# Altium schematic sheet AMC_Connector.SchDoc: =ProjectName
size 420 x 297 mm; Author: T.P.; CompanyName: WUT; DrawnBy: T.P.; Organization: WUT ISE; Address1: Warsaw Univeristy of Technology; Address2: Nowowiejska 15/19; DocumentNumber: 35; Revision: 0.9; SheetNumber: 35; SheetTotal: 36; EDA_Number: ARTIQ; Projet: ARTIQ/SINARA; ModifiedBy: -; CreateDate: XX/XX/XXXX; CheckedDate: -; Title2: AMC_Connector.SchDoc; DivGrp: ISE; Designer: G.K. and T.P.; ModifiedDate: -; ProjectName: ADC/DAC MEZZANINE
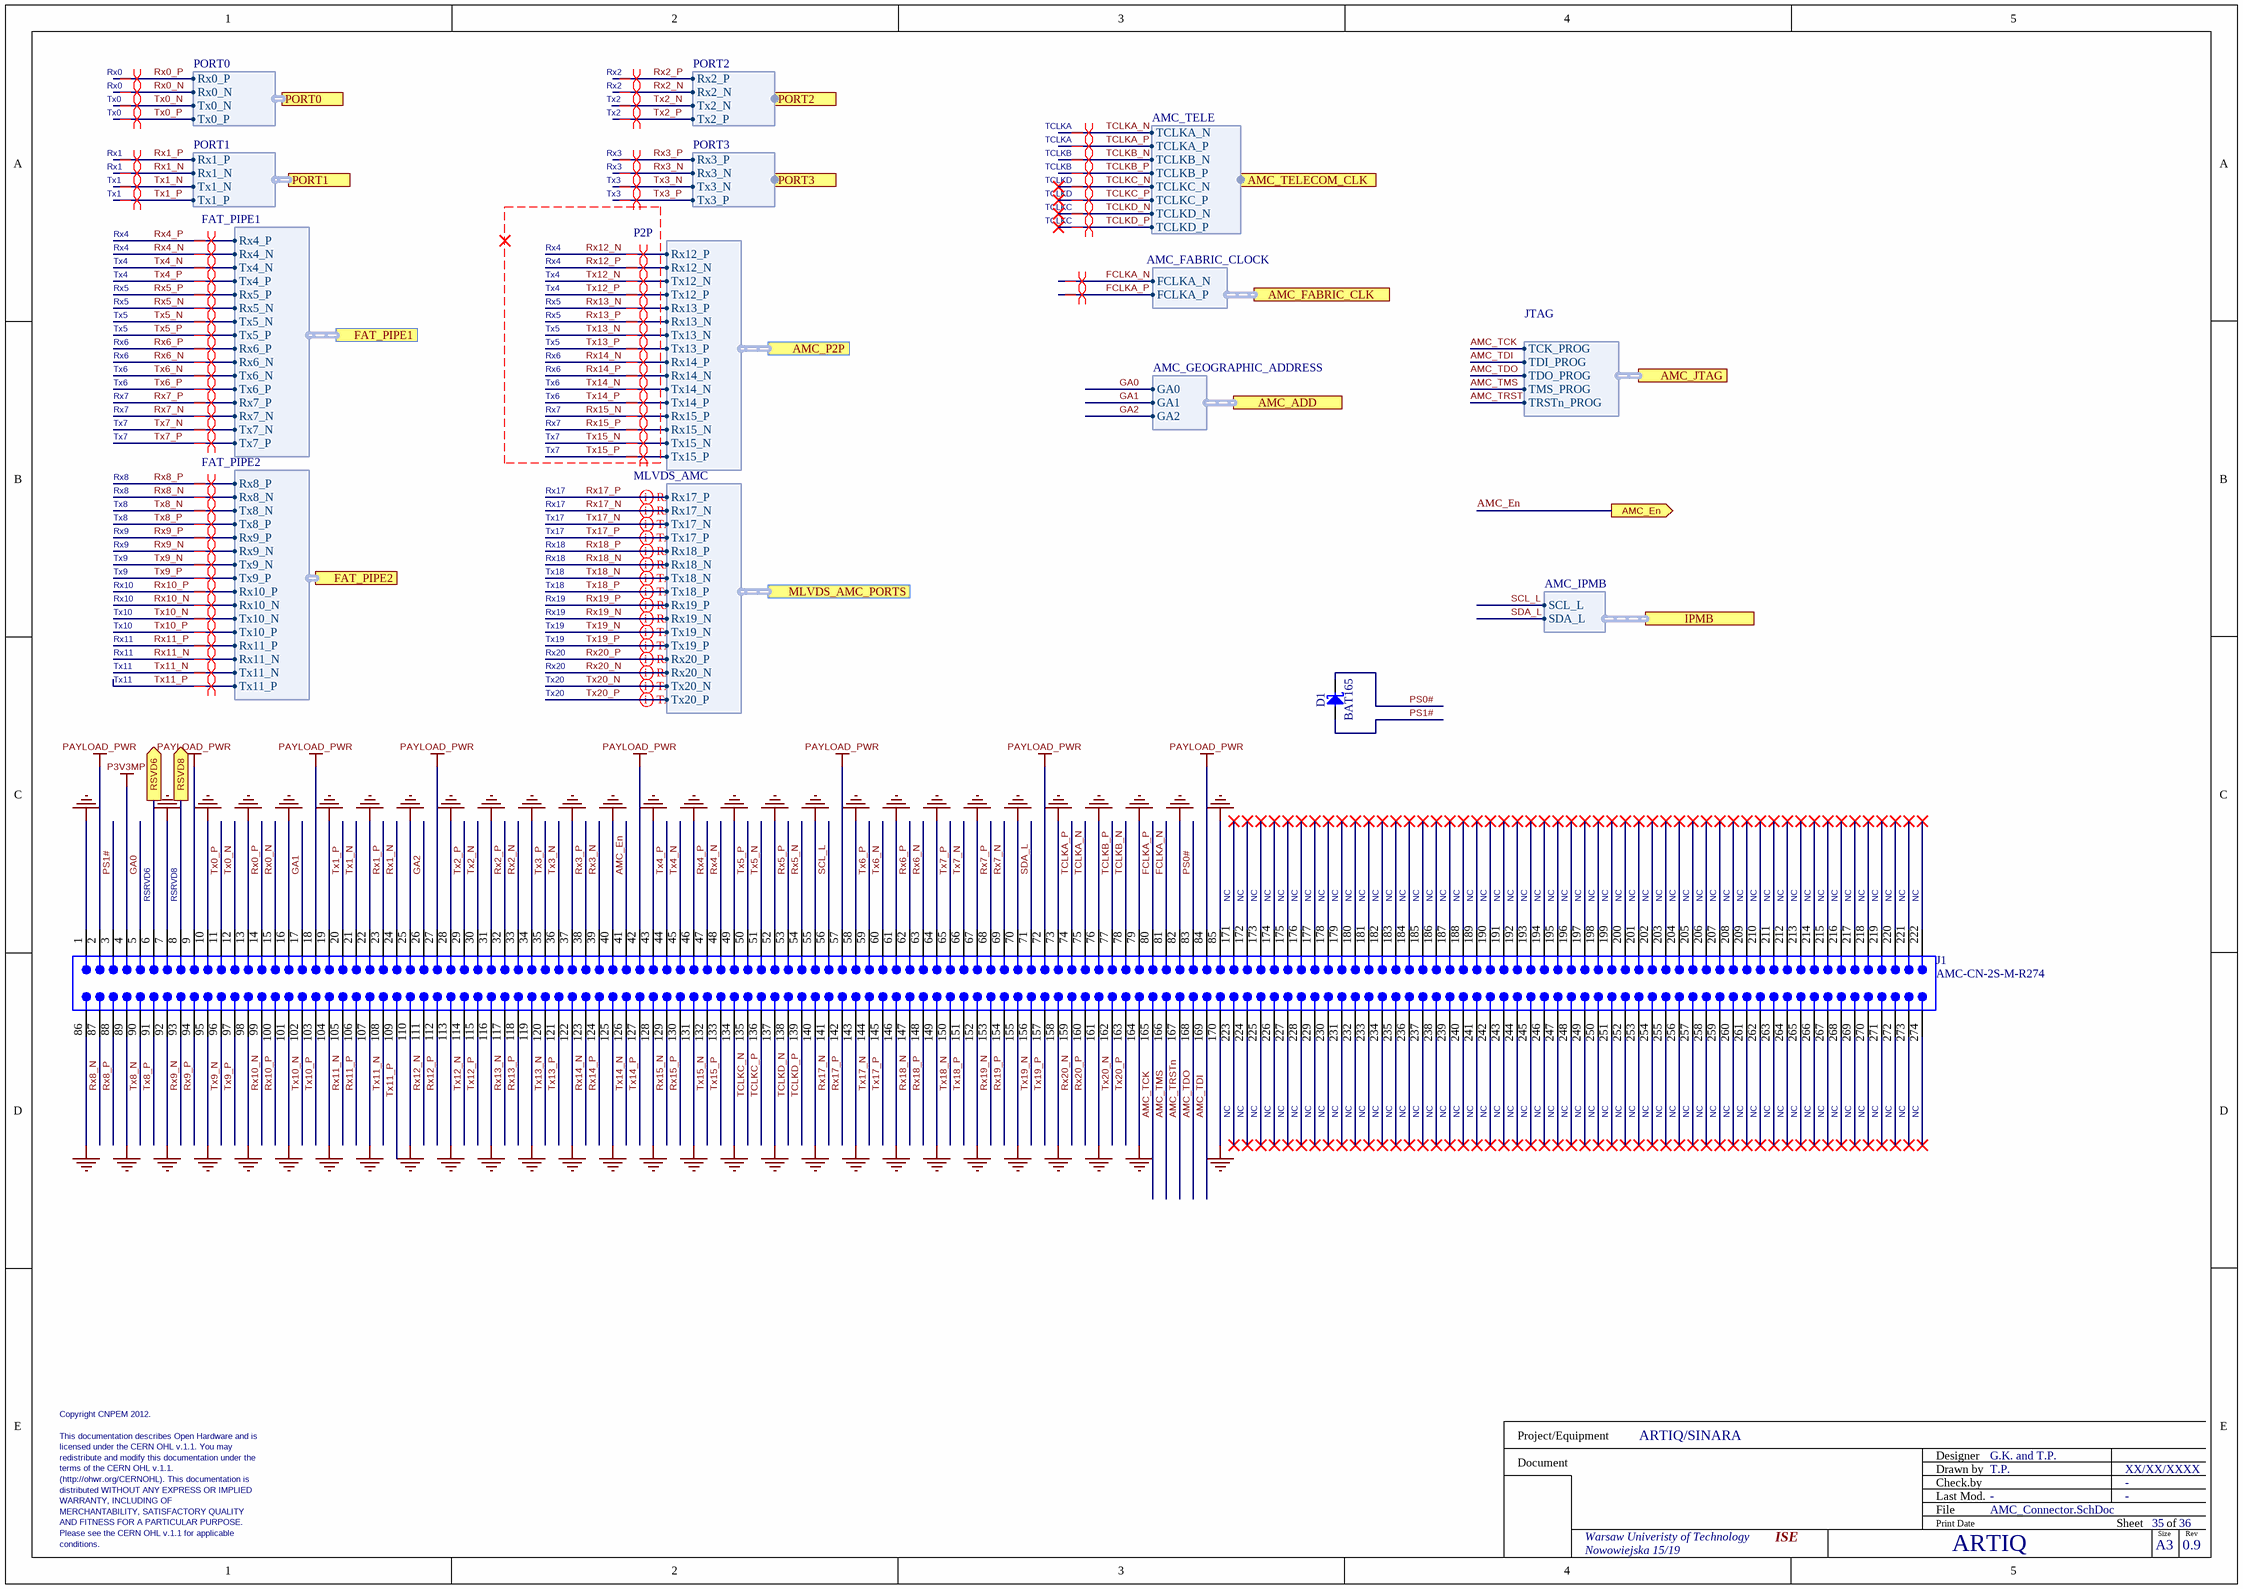
[diagram p0: AMC_Connector.SchDoc]

## Parts
D1  BAT165  [SOD2512X110N]
J1  AMC-CN-2S-M-R274  [AMC-GF-2D-750-O274]  (no BOM)

## Ports
AMC_ADD (harness AMC_GEOGRAPHIC_ADDRESS), AMC_En (out), AMC_FABRIC_CLK (harness AMC_FABRIC_CLOCK), AMC_JTAG (harness JTAG), AMC_P2P (harness P2P), AMC_TELECOM_CLK (harness AMC_TELE), FAT_PIPE1 (harness FAT_PIPE1), FAT_PIPE2 (harness FAT_PIPE2), IPMB (harness AMC_IPMB), MLVDS_AMC_PORTS (harness MLVDS_AMC), PORT0 (harness PORT0), PORT1 (harness PORT1), PORT2 (harness PORT2), PORT3 (harness PORT3), RSVD6 (out), RSVD8 (out)

## Harnesses
PORT0: Rx0_P, Rx0_N, Tx0_N, Tx0_P
PORT1: Rx1_P, Rx1_N, Tx1_N, Tx1_P
FAT_PIPE1: Rx4_P, Rx4_N, Tx4_N, Tx4_P, Rx5_P, Rx5_N, Tx5_N, Tx5_P, Rx6_P, Rx6_N, Tx6_N, Tx6_P, Rx7_P, Rx7_N, Tx7_N, Tx7_P
PORT2: Rx2_P, Rx2_N, Tx2_N, Tx2_P
PORT3: Rx3_P, Rx3_N, Tx3_N, Tx3_P
FAT_PIPE2: Rx8_P, Rx8_N, Tx8_N, Tx8_P, Rx9_P, Rx9_N, Tx9_N, Tx9_P, Rx10_P, Rx10_N, Tx10_N, Tx10_P, Rx11_P, Rx11_N, Tx11_N, Tx11_P
P2P: Rx12_P, Rx12_N, Tx12_N, Tx12_P, Rx13_P, Rx13_N, Tx13_N, Tx13_P, Rx14_P, Rx14_N, Tx14_N, Tx14_P, Rx15_P, Rx15_N, Tx15_N, Tx15_P
MLVDS_AMC: Rx17_P, Rx17_N, Tx17_N, Tx17_P, Rx18_P, Rx18_N, Tx18_N, Tx18_P, Rx19_P, Rx19_N, Tx19_N, Tx19_P, Rx20_P, Rx20_N, Tx20_N, Tx20_P
AMC_GEOGRAPHIC_ADDRESS: GA0, GA1, GA2
AMC_IPMB: SCL_L, SDA_L
JTAG: TDO_PROG, TDI_PROG, TCK_PROG, TMS_PROG, TRSTn_PROG
AMC_FABRIC_CLOCK: FCLKA_N, FCLKA_P
AMC_TELE: TCLKA_N, TCLKA_P, TCLKB_N, TCLKB_P, TCLKC_N, TCLKC_P, TCLKD_N, TCLKD_P

## Nets
GND: J1.1 J1.7 J1.10 J1.13 J1.16 J1.19 J1.22 J1.25 J1.28 J1.31 J1.34 J1.37 J1.40 J1.43 J1.46 J1.49 J1.52 J1.55 J1.58 J1.61 J1.64 J1.67 J1.70 J1.73 J1.76 J1.79 J1.82 J1.85 J1.86 J1.89 J1.92 J1.95 J1.98 J1.101 J1.104 J1.107 J1.110 J1.113 J1.116 J1.119 J1.122 J1.125 J1.128 J1.131 J1.134 J1.137 J1.140 J1.143 J1.146 J1.149 J1.152 J1.155 J1.158 J1.161 J1.164 J1.170
P3V3MP: J1.4
PAYLOAD_PWR: J1.2 J1.9 J1.18 J1.27 J1.42 J1.57 J1.72 J1.84
AMC_En: J1.41 ; port AMC_En
AMC_TCK: J1.165 ; port AMC_JTAG.TCK_PROG
AMC_TDI: J1.169 ; port AMC_JTAG.TDI_PROG
AMC_TDO: J1.168 ; port AMC_JTAG.TDO_PROG
AMC_TMS: J1.166 ; port AMC_JTAG.TMS_PROG
AMC_TRSTn: J1.167 ; port AMC_JTAG.TRSTn_PROG
FCLKA_N: J1.81 ; port AMC_FABRIC_CLK.FCLKA_N
FCLKA_P: J1.80 ; port AMC_FABRIC_CLK.FCLKA_P
GA0: J1.5 ; port AMC_ADD.GA0
GA1: J1.17 ; port AMC_ADD.GA1
GA2: J1.26 ; port AMC_ADD.GA2
PS0#: D1.1(C) J1.83
PS1#: D1.2(A) J1.3
RSVD6: J1.6 ; port RSVD6
RSVD8: J1.8 ; port RSVD8
Rx0_N: J1.15 ; port PORT0.Rx0_N
Rx0_P: J1.14 ; port PORT0.Rx0_P
Rx1_N: J1.24 ; port PORT1.Rx1_N
Rx1_P: J1.23 ; port PORT1.Rx1_P
Rx2_N: J1.33 ; port PORT2.Rx2_N
Rx2_P: J1.32 ; port PORT2.Rx2_P
Rx3_N: J1.39 ; port PORT3.Rx3_N
Rx3_P: J1.38 ; port PORT3.Rx3_P
Rx4_N: J1.48 ; port FAT_PIPE1.Rx4_N
Rx4_P: J1.47 ; port FAT_PIPE1.Rx4_P
Rx5_N: J1.54 ; port FAT_PIPE1.Rx5_N
Rx5_P: J1.53 ; port FAT_PIPE1.Rx5_P
Rx6_N: J1.63 ; port FAT_PIPE1.Rx6_N
Rx6_P: J1.62 ; port FAT_PIPE1.Rx6_P
Rx7_N: J1.69 ; port FAT_PIPE1.Rx7_N
Rx7_P: J1.68 ; port FAT_PIPE1.Rx7_P
Rx8_N: J1.87 ; port FAT_PIPE2.Rx8_N
Rx8_P: J1.88 ; port FAT_PIPE2.Rx8_P
Rx9_N: J1.93 ; port FAT_PIPE2.Rx9_N
Rx9_P: J1.94 ; port FAT_PIPE2.Rx9_P
Rx10_N: J1.99 ; port FAT_PIPE2.Rx10_N
Rx10_P: J1.100 ; port FAT_PIPE2.Rx10_P
Rx11_N: J1.105 ; port FAT_PIPE2.Rx11_N
Rx11_P: J1.106 ; port FAT_PIPE2.Rx11_P
Rx12_N: J1.111 ; port AMC_P2P.Rx12_P
Rx12_P: J1.112 ; port AMC_P2P.Rx12_N
Rx13_N: J1.117 ; port AMC_P2P.Rx13_P
Rx13_P: J1.118 ; port AMC_P2P.Rx13_N
Rx14_N: J1.123 ; port AMC_P2P.Rx14_P
Rx14_P: J1.124 ; port AMC_P2P.Rx14_N
Rx15_N: J1.129 ; port AMC_P2P.Rx15_P
Rx15_P: J1.130 ; port AMC_P2P.Rx15_N
Rx17_N: J1.141 ; port MLVDS_AMC_PORTS.Rx17_N
Rx17_P: J1.142 ; port MLVDS_AMC_PORTS.Rx17_P
Rx18_N: J1.147 ; port MLVDS_AMC_PORTS.Rx18_N
Rx18_P: J1.148 ; port MLVDS_AMC_PORTS.Rx18_P
Rx19_N: J1.153 ; port MLVDS_AMC_PORTS.Rx19_N
Rx19_P: J1.154 ; port MLVDS_AMC_PORTS.Rx19_P
Rx20_N: J1.159 ; port MLVDS_AMC_PORTS.Rx20_N
Rx20_P: J1.160 ; port MLVDS_AMC_PORTS.Rx20_P
SCL_L: J1.56 ; port IPMB.SCL_L
SDA_L: J1.71 ; port IPMB.SDA_L
TCLKA_N: J1.75 ; port AMC_TELECOM_CLK.TCLKA_N
TCLKA_P: J1.74 ; port AMC_TELECOM_CLK.TCLKA_P
TCLKB_N: J1.78 ; port AMC_TELECOM_CLK.TCLKB_N
TCLKB_P: J1.77 ; port AMC_TELECOM_CLK.TCLKB_P
TCLKC_N: J1.135 ; port AMC_TELECOM_CLK.TCLKC_N
TCLKC_P: J1.136 ; port AMC_TELECOM_CLK.TCLKC_P
TCLKD_N: J1.138 ; port AMC_TELECOM_CLK.TCLKD_N
TCLKD_P: J1.139 ; port AMC_TELECOM_CLK.TCLKD_P
Tx0_N: J1.12 ; port PORT0.Tx0_N
Tx0_P: J1.11 ; port PORT0.Tx0_P
Tx1_N: J1.21 ; port PORT1.Tx1_N
Tx1_P: J1.20 ; port PORT1.Tx1_P
Tx2_N: J1.30 ; port PORT2.Tx2_N
Tx2_P: J1.29 ; port PORT2.Tx2_P
Tx3_N: J1.36 ; port PORT3.Tx3_N
Tx3_P: J1.35 ; port PORT3.Tx3_P
Tx4_N: J1.45 ; port FAT_PIPE1.Tx4_N
Tx4_P: J1.44 ; port FAT_PIPE1.Tx4_P
Tx5_N: J1.51 ; port FAT_PIPE1.Tx5_N
Tx5_P: J1.50 ; port FAT_PIPE1.Tx5_P
Tx6_N: J1.60 ; port FAT_PIPE1.Tx6_N
Tx6_P: J1.59 ; port FAT_PIPE1.Tx6_P
Tx7_N: J1.66 ; port FAT_PIPE1.Tx7_N
Tx7_P: J1.65 ; port FAT_PIPE1.Tx7_P
Tx8_N: J1.90 ; port FAT_PIPE2.Tx8_N
Tx8_P: J1.91 ; port FAT_PIPE2.Tx8_P
Tx9_N: J1.96 ; port FAT_PIPE2.Tx9_N
Tx9_P: J1.97 ; port FAT_PIPE2.Tx9_P
Tx10_N: J1.102 ; port FAT_PIPE2.Tx10_N
Tx10_P: J1.103 ; port FAT_PIPE2.Tx10_P
Tx11_N: J1.108 ; port FAT_PIPE2.Tx11_N
Tx11_P: J1.109 ; port FAT_PIPE2.Tx11_P
Tx12_N: J1.114 ; port AMC_P2P.Tx12_N
Tx12_P: J1.115 ; port AMC_P2P.Tx12_P
Tx13_N: J1.120 ; port AMC_P2P.Tx13_N
Tx13_P: J1.121 ; port AMC_P2P.Tx13_P
Tx14_N: J1.126 ; port AMC_P2P.Tx14_N
Tx14_P: J1.127 ; port AMC_P2P.Tx14_P
Tx15_N: J1.132 ; port AMC_P2P.Tx15_N
Tx15_P: J1.133 ; port AMC_P2P.Tx15_P
Tx17_N: J1.144 ; port MLVDS_AMC_PORTS.Tx17_N
Tx17_P: J1.145 ; port MLVDS_AMC_PORTS.Tx17_P
Tx18_N: J1.150 ; port MLVDS_AMC_PORTS.Tx18_N
Tx18_P: J1.151 ; port MLVDS_AMC_PORTS.Tx18_P
Tx19_N: J1.156 ; port MLVDS_AMC_PORTS.Tx19_N
Tx19_P: J1.157 ; port MLVDS_AMC_PORTS.Tx19_P
Tx20_N: J1.162 ; port MLVDS_AMC_PORTS.Tx20_N
Tx20_P: J1.163 ; port MLVDS_AMC_PORTS.Tx20_P

Not connected (* = marked no-connect by the designer): J1 171* 172* 173* 174* 175* 176* 177* 178* 179* 180* 181* 182* 183* 184* 185* 186* 187* 188* 189* 190* 191* 192* 193* 194* 195* 196* 197* 198* 199* 200* 201* 202* 203* 204* 205* 206* 207* 208* 209* 210* 211* 212* 213* 214* 215* 216* 217* 218* 219* 220* 221* 222* 223* 224* 225* 226* 227* 228* 229* 230* 231* 232* 233* 234* 235* 236* 237* 238* 239* 240* 241* 242* 243* 244* 245* 246* 247* 248* 249* 250* 251* 252* 253* 254* 255* 256* 257* 258* 259* 260* 261* 262* 263* 264* 265* 266* 267* 268* 269* 270* 271* 272* 273* 274*

## Layout directives
differential pair: Rx17_N, Rx17_P, Rx18_N, Rx18_P, Rx19_N, Rx19_P, Rx20_N, Rx20_P, Tx17_N, Tx17_P, Tx18_N, Tx18_P, Tx19_N, Tx19_P, Tx20_N, Tx20_P
differential pair; differential pair class Diff_100Ohm: FCLKA_N, FCLKA_P, Rx0_N, Rx0_P, Rx1_N, Rx1_P, Rx2_N, Rx2_P, Rx3_N, Rx3_P, Rx4_N, Rx4_P, Rx5_N, Rx5_P, Rx6_N, Rx6_P, Rx7_N, Rx7_P, Rx8_N, Rx8_P, Rx9_N, Rx9_P, Rx10_N, Rx10_P, Rx11_N, Rx11_P, Rx12_N, Rx12_P, Rx13_N, Rx13_P, Rx14_N, Rx14_P, Rx15_N, Rx15_P, TCLKA_N, TCLKA_P, TCLKB_N, TCLKB_P, TCLKC_N, TCLKC_P, TCLKD_N, TCLKD_P, Tx0_N, Tx0_P, Tx1_N, Tx1_P, Tx2_N, Tx2_P, Tx3_N, Tx3_P, Tx4_N, Tx4_P, Tx5_N, Tx5_P, Tx6_N, Tx6_P, Tx7_N, Tx7_P, Tx8_N, Tx8_P, Tx9_N, Tx9_P, Tx10_N, Tx10_P, Tx11_N, Tx11_P, Tx12_N, Tx12_P, Tx13_N, Tx13_P, Tx14_N, Tx14_P, Tx15_N, Tx15_P

## Notes on the sheet
- Tx0
- Rx0
- Tx2
- Rx2
- TCLKA
- Tx1
- Rx1
- Tx3
- Rx3
- TCLKD
- TCLKB
- Tx4
- Rx4
- TCLKC
- Tx5
- Rx5
- Tx6
- Rx7
- Rx6
- Tx7
- Tx8
- Rx9
- Rx8
- Tx17
- Rx17
- Tx9
- Rx10
- Tx18
- Rx18
- Tx11
- Tx10
- Rx11
- Tx19
- Rx20
- Rx19
- Tx20
- RSRVD6
- RSRVD8
- NC
- Copyright CNPEM 2012.
- (http://ohwr.org/CERNOHL). This documentation is
- terms of the CERN OHL v.1.1.
- redistribute and modify this documentation under the
- licensed under the CERN OHL v.1.1. You may
- This documentation describes Open Hardware and is
- conditions.
- Please see the CERN OHL v.1.1 for applicable
- AND FITNESS FOR A PARTICULAR PURPOSE.
- MERCHANTABILITY, SATISFACTORY QUALITY
- WARRANTY, INCLUDING OF
- distributed WITHOUT ANY EXPRESS OR IMPLIED
- Project/Equipment
- Document
- Designer
- Drawn by
- Check.by
- File
- Last Mod.
- Print Date
- Sheet
- Size
- A3
- of
- Rev

## Library data of the parts
D1 = BAT165: Schottky Diode; Manufacturer: INFINEON; Part Description: Medium Power AF Schottky Diode; Voltage: 40V; Power: 750mA; PressFit: No; Bonding: No; Manufacturer Part Number: BAT165; PackageDescription: Small Outline Diode (SOD-323), 1.70mm W X 1.25mm L X 1.10mm H body,  IPC Medium Density; Part Number: BAT165; Component Kind: Standard; Component Type: Standard; Device: BAT165; Pin Count: 2; Case: SOD323; Mounted: Yes; Socket: No; SMD: Yes; Sense: No; ComponentHeight: 1.1mm; HelpURL: \\cern.ch\dfs\Applications\Altium\Datasheets\BAT165.pdf; Author: CERN DEM JLC; CreateDate: 12.11.2014; LatestRevisionDate: 12.11.2014
J1 = CMP-0001-00058-2: Golden finger, AMC, Dual, Opposite, Pitch 0.75mm, 170-Position; Package Version: rev2.0, Nov-2006; Mating Connector: Molex-0758000001; Datasheet Version: rev2.0, Nov-2006; ClassName: Edge Connector; Package Reference: AMC-GF-2D-750-O274; Publisher: Altium